# EAGLE schematic battery_board (EAGLE 6.4)
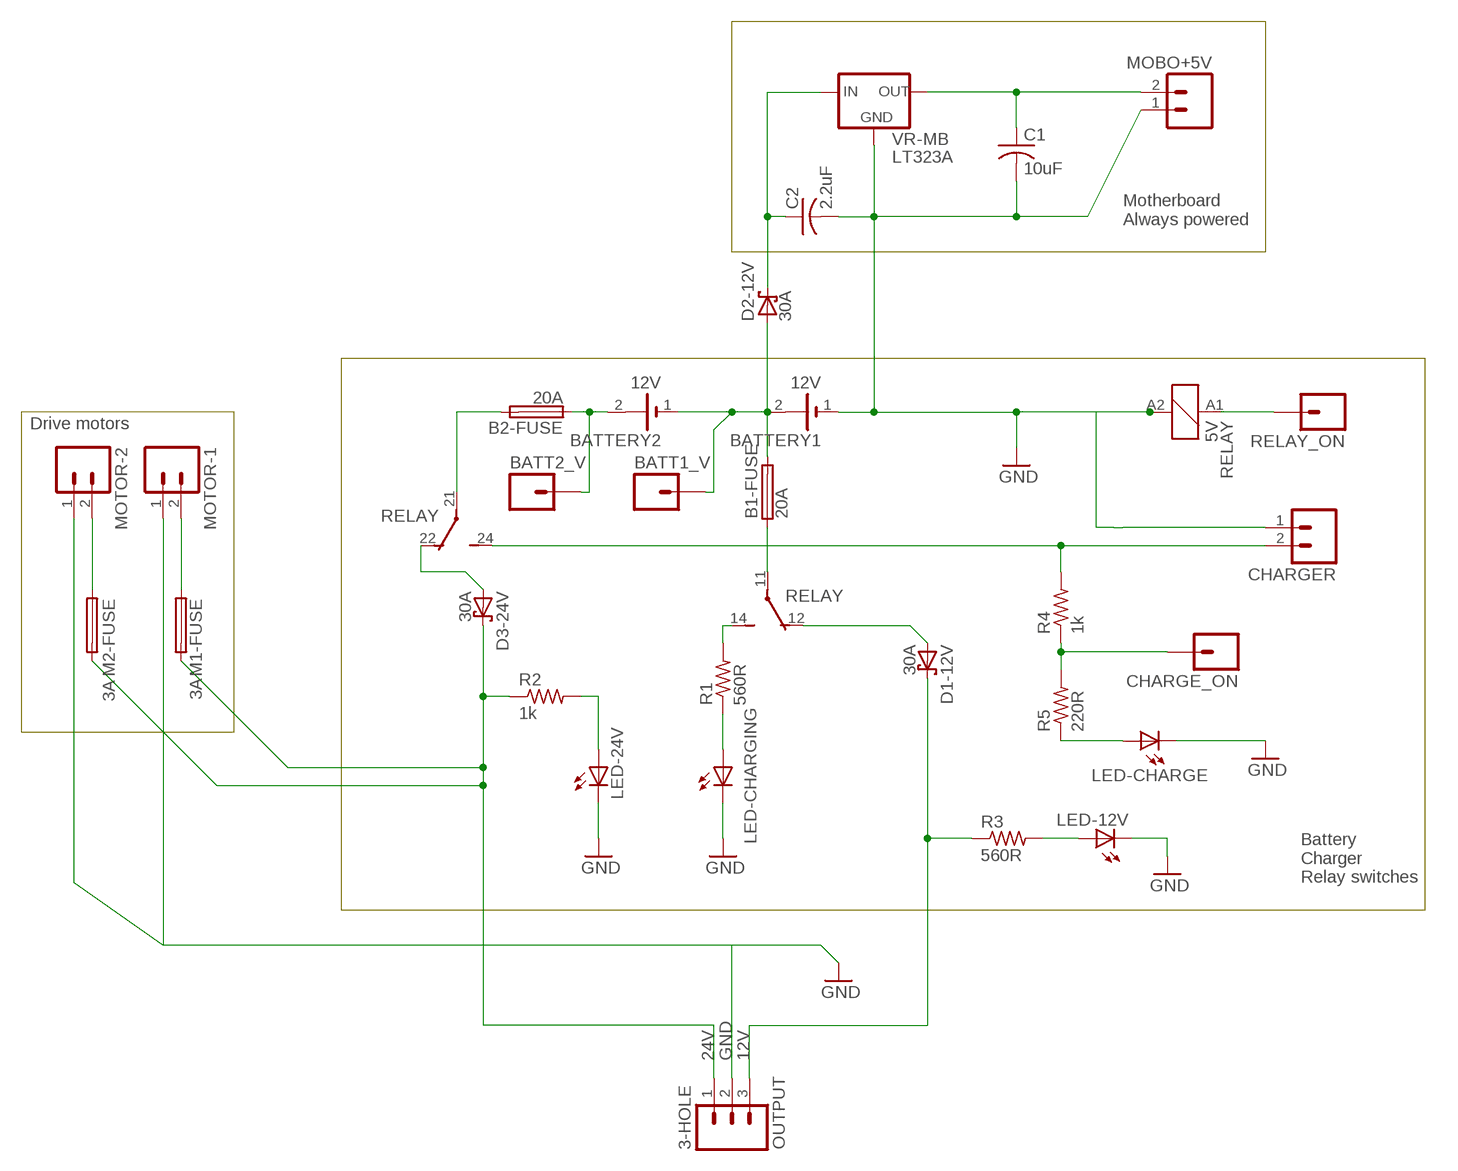
[diagram p0: schematic, sheet 1]

## Parts
B1-FUSE  20A  FUSEBLADE  [FUSE_BLADE]
B2-FUSE  20A  FUSEBLADE  [FUSE_BLADE]
BATT1_V  1-HOLE  [1-HOLE_BIG]
BATT2_V  1-HOLE  [1-HOLE_BIG]
BATTERY1  12V  BATTERY-ST  [SCREWTERMINAL-5MM-2]
BATTERY2  12V  BATTERY-ST  [SCREWTERMINAL-5MM-2]
C1  10uF  CAPACITOR  [C050-024X044]
C2  2.2uF  CAPACITOR  [C050-024X044]
CHARGE_ON  1-HOLE  [1-HOLE_BIG]
CHARGER  24V  2-HOLESSC5MM  [SCREWTERMINAL-5MM-2]
D1-12V  30A  NTST30100SG-H  [TO22-DIODE-H]
D2-12V  30A  NTST30100SG-H  [TO22-DIODE-H]
D3-24V  30A  NTST30100SG-H  [TO22-DIODE-H]
LED-12V  LED-5MM  [LED5MM]
LED-24V  LED-5MM  [LED5MM]
LED-CHARGE  LED-5MM  [LED5MM]
LED-CHARGING  LED-5MM  [LED5MM]
M1-FUSE  3A  FUSE  [FUSE-5X20MM_SMD]
M2-FUSE  3A  FUSE  [FUSE-5X20MM_SMD]
MOBO+5V  2-HOLESSC3.81MM  [SCREWTERMINAL-3.81MM]
MOTOR-1  2-HOLESSC5MM  [SCREWTERMINAL-5MM-2]
MOTOR-2  2-HOLESSC5MM  [SCREWTERMINAL-5MM-2]
OUTPUT  3-HOLE  [SCREWTERMINAL-5MM-3]
R1  560R  RESISTOR0207/10  [0207/10]
R2  1k  RESISTOR0207/10  [0207/10]
R3  560R  RESISTOR0207/10  [0207/10]
R4  1k  RESISTOR0207/10  [0207/10]
R5  220R  RESISTOR0207/10  [0207/10]
RELAY  5V  RT424A05  [RELAY_RT2]
RELAY_ON  1-HOLE"  [1-HOLE]
VR-MB  LT323A  LT323AT-SINK  [TO220V-HEATSINK]

## Nets
12V [battery]: D1-12V.P$2(C) OUTPUT.3 R3.1
24V [battery]: D3-24V.P$2(C) M1-FUSE.P$2 M2-FUSE.P$2 OUTPUT.1 R2.1
GND [ground]: BATTERY1.1(-) C1.2 C2.2 CHARGER.1 LED-12V.K(C) LED-24V.K(C) LED-CHARGE.K(C) LED-CHARGING.K(C) MOBO+5V.1 MOTOR-1.1 MOTOR-2.1 OUTPUT.2 RELAY.A2 VR-MB.2(GND)
N$1 [battery]: B1-FUSE.P$2 BATT1_V.P$1 BATTERY1.2(+) BATTERY2.1(-) D2-12V.P$1(A)
N$2 [battery]: CHARGER.2 R4.2 RELAY.24(3:S)
N$3: LED-24V.A R2.2
N$4 [battery]: D3-24V.P$1(A) RELAY.22(3:O)
N$5 [battery]: B2-FUSE.P$1 BATT2_V.P$1 BATTERY2.2(+)
N$6 [battery]: D1-12V.P$1(A) RELAY.12(2:O)
N$7: LED-CHARGING.A R1.1
N$8 [battery]: C1.1 MOBO+5V.2 VR-MB.3(OUT)
N$9 [battery]: M1-FUSE.P$1 MOTOR-1.2
N$10 [battery]: M2-FUSE.P$1 MOTOR-2.2
N$11: RELAY.A1 RELAY_ON.1
N$12 [battery]: C2.1 D2-12V.P$2(C) VR-MB.1(IN)
N$13: R1.2 RELAY.14(2:S)
N$14: LED-12V.A R3.2
N$15: CHARGE_ON.P$1 R4.1 R5.2
N$16: LED-CHARGE.A R5.1
N$20 [battery]: B2-FUSE.P$2 RELAY.21(3:P)
N$39 [battery]: B1-FUSE.P$1 RELAY.11(2:P)

## Notes on the sheet
- Motherboard
  Always powered
- Drive motors
- Battery
  Charger
  Relay switches

## Library data of the parts
B1-FUSE B2-FUSE M1-FUSE M2-FUSE = parts:FUSE: FUSE
BATT1_V BATT2_V CHARGE_ON RELAY_ON = parts:1-HOLE: ONE HOLE Single hole on board
BATTERY1 BATTERY2 = parts:BATTERY: BATTERY battery with hole variants to mount to board
C1 C2 = parts:CAPACITOR: CAPACITOR, American symbol
CHARGER MOBO+5V MOTOR-1 MOTOR-2 = parts:2-HOLES: TERMINAL 2-PIN Holes for connecting 2 pin terminal
D1-12V D2-12V D3-24V = parts:NTST30100SG: <DIODE NTST30100SG Schottky 100V 30A rectifier
LED-12V LED-24V LED-CHARGE LED-CHARGING = parts:LED: LEDs Standard schematic elements and footprints for 5mm, 3mm, 1206, and 0603 sized LEDs. 5mm - Spark Fun Electronics SKU : COM-00529 (and others)
OUTPUT = parts:3-HOLE: TERMINAL 3-PIN
R1-R5 = parts:RESISTOR: RESISTOR
RELAY = parts:RT424A: Relay DPDT DPDT relay 8A contact 5V coil; MPN: RT424A05; OC_FARNELL: unknown; OC_NEWARK: 48M7975
VR-MB = parts:LT323AT: VOLTAGE REGULATOR 5V 3A voltage regulator

## Net classes
1 ground: width 1.016 mm, clearance 0.762 mm
2 battery: width 1.27 mm, clearance 0.762 mm